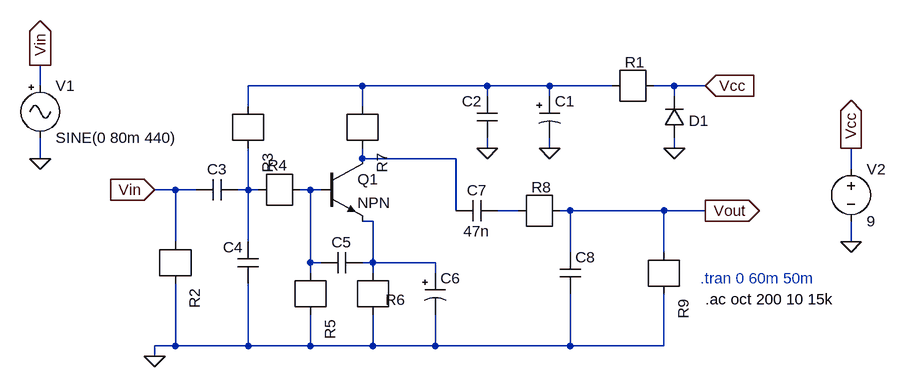
[diagram p0: schematic booster.asc]
booster.asc, the LTspice schematic file:
Version 4
SHEET 1 1036 680
WIRE -288 64 -288 32
WIRE 208 64 32 64
WIRE 400 64 208 64
WIRE 496 64 400 64
WIRE 592 64 496 64
WIRE 688 64 656 64
WIRE 736 64 688 64
WIRE 400 80 400 64
WIRE 496 80 496 64
WIRE 688 80 688 64
WIRE 32 96 32 64
WIRE 208 96 208 64
WIRE 400 160 400 144
WIRE 496 160 496 144
WIRE 688 160 688 144
WIRE -288 176 -288 144
WIRE 208 176 208 160
WIRE 352 176 208 176
WIRE 960 192 960 160
WIRE -80 224 -112 224
WIRE -48 224 -80 224
WIRE 32 224 32 160
WIRE 32 224 16 224
WIRE 48 224 32 224
WIRE 128 224 112 224
WIRE 144 224 128 224
WIRE 352 256 352 176
WIRE 448 256 416 256
WIRE 528 256 512 256
WIRE 672 256 528 256
WIRE 736 256 672 256
WIRE 224 272 208 272
WIRE -80 304 -80 224
WIRE 32 304 32 224
WIRE 960 304 960 272
WIRE 528 320 528 256
WIRE 672 320 672 256
WIRE 128 336 128 224
WIRE 144 336 128 336
WIRE 224 336 224 272
WIRE 224 336 208 336
WIRE 320 336 224 336
WIRE 128 352 128 336
WIRE 224 352 224 336
WIRE 320 352 320 336
WIRE -80 464 -80 368
WIRE -80 464 -112 464
WIRE 32 464 32 368
WIRE 32 464 -80 464
WIRE 128 464 128 416
WIRE 128 464 32 464
WIRE 224 464 224 416
WIRE 224 464 128 464
WIRE 320 464 320 416
WIRE 320 464 224 464
WIRE 528 464 528 384
WIRE 528 464 320 464
WIRE 672 464 672 384
WIRE 672 464 528 464
WIRE -112 480 -112 464
FLAG -112 224 Vin
IOPIN -112 224 In
FLAG -112 480 0
FLAG 496 160 0
FLAG 736 64 Vcc
IOPIN 736 64 In
FLAG 736 256 Vout
IOPIN 736 256 Out
FLAG -288 32 Vin
IOPIN -288 32 Out
FLAG -288 176 0
FLAG 960 304 0
FLAG 960 160 Vcc
IOPIN 960 160 Out
FLAG 400 160 0
FLAG 688 160 0
SYMBOL npn 144 176 R0
SYMATTR InstName Q1
SYMBOL r 48 224 R0
WINDOW 0 45 -38 Right 2
WINDOW 3 46 32 Right 2
SYMATTR InstName R4
SYMATTR Value ""
SYMBOL r 32 96 R90
SYMATTR InstName R3
SYMATTR Value ""
SYMBOL r 128 352 R90
SYMATTR InstName R5
SYMATTR Value ""
SYMBOL r 224 352 R90
WINDOW 0 41 -50 VRight 2
WINDOW 3 14 -60 VRight 2
SYMATTR InstName R6
SYMATTR Value ""
SYMBOL r 208 96 R90
SYMATTR InstName R7
SYMATTR Value ""
SYMBOL r 656 64 R180
WINDOW 0 44 36 Right 2
WINDOW 3 59 -32 Right 2
SYMATTR InstName R1
SYMATTR Value ""
SYMBOL cap 16 208 R90
WINDOW 0 0 32 VBottom 2
WINDOW 3 32 32 VTop 2
SYMATTR InstName C3
SYMATTR Value ""
SYMBOL cap 416 240 R90
WINDOW 0 0 32 VBottom 2
WINDOW 3 32 32 VTop 2
SYMATTR InstName C7
SYMATTR Value 47n
SYMBOL cap 144 352 R270
WINDOW 0 32 32 VTop 2
WINDOW 3 0 32 VBottom 2
SYMATTR InstName C5
SYMATTR Value ""
SYMBOL polcap 304 352 R0
SYMATTR InstName C6
SYMATTR Value ""
SYMBOL polcap 480 80 R0
SYMATTR InstName C1
SYMATTR Value ""
SYMBOL cap 512 320 R0
SYMATTR InstName C8
SYMATTR Value ""
SYMBOL r 672 320 R90
SYMATTR InstName R9
SYMATTR Value ""
SYMBOL signal -288 48 R0
SYMATTR InstName V1
SYMATTR Value SINE(0 80m 440)
SYMATTR Value2 AC 15m
SYMBOL voltage 960 176 R0
SYMATTR InstName V2
SYMATTR Value 9
SYMBOL r -80 304 R90
SYMATTR InstName R2
SYMATTR Value ""
SYMBOL cap 416 144 R180
WINDOW 0 24 56 Left 2
WINDOW 3 24 8 Left 2
SYMATTR InstName C2
SYMATTR Value ""
SYMBOL r 512 256 R180
WINDOW 0 44 36 Right 2
WINDOW 3 59 -32 Right 2
SYMATTR InstName R8
SYMATTR Value ""
SYMBOL cap 48 368 R180
WINDOW 0 24 56 Left 2
WINDOW 3 24 8 Left 2
SYMATTR InstName C4
SYMATTR Value ""
SYMBOL diode 704 144 R180
WINDOW 0 -37 26 Left 2
WINDOW 3 24 0 Left 2
SYMATTR InstName D1
SYMATTR Value ""
TEXT 728 360 Left 2 ;.tran 0 60m 50m
TEXT 736 392 Left 2 !.ac oct 200 10 15k

The netlist it stands for:
* booster.asc
Q1 N002 N004 N006 0 NPN
R4 N004 N003
R3 N003 N001
R5 0 N004
R6 0 N006
R7 N002 N001
R1 N001 Vcc
C3 N003 Vin
C7 N005 N002 47n
C5 N004 N006
C6 N006 0
C1 N001 0
C8 Vout 0
R9 0 Vout
V1 Vin 0 SINE(0 80m 440) AC 15m
V2 Vcc 0 9
R2 0 Vin
C2 0 N001
R8 N005 Vout
C4 0 N003
D1 0 Vcc
.model D D
.lib standard.dio
.model NPN NPN
.model PNP PNP
.lib standard.bjt
* .tran 0 60m 50m
.ac oct 200 10 15k
.backanno
.end